# Altium project PCB_DCND_V2_PART_2.PrjPcb
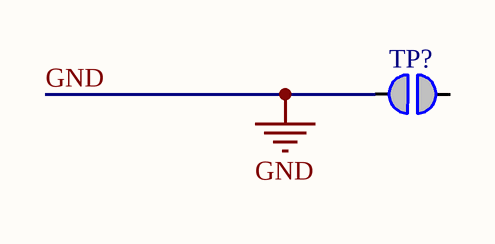
[diagram p0: Sheet.SchDoc]
1 sheet, 1 parts. Net scope: global (net labels, ports and power ports of the same name join across sheets).
Board file: PCB.PcbDoc

## Sheet Sheet.SchDoc
size A4

### Parts
TP?  Solderbridge  [Solderbridge]  (value not drawn)  (no BOM)

### Nets
GND: TP?.2

Not connected (* = marked no-connect by the designer): TP? 1(0)

### Library data of the parts
TP? = Solderbridge: Artikkelnr Noca: N.A.; Part Number: Solderbridge; Manufacturer: *; Manufacturer Part Number: *; Datasheet: *; LatestRevisionDate: 2009-12-14; Pin Count: 2; Publisher: Nordic Semiconductor; Published: 2009-12-14; Value: Solderbridge; Note: *; Supplier: *; Supplier part number: *; 2nd source Supplier: *; 2nd source part number: *; Footprint Doc: Solderbridge; Artikkelnr Simpro: N.A.